# EAGLE design Test (EAGLE 6.4)
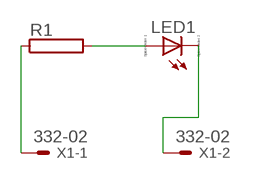
[diagram p0: schematic, sheet 1]

## Parts
LED1  LED_ELD260  [LED_LD260]
R1  RAC01  [AC01]
X1  332-02  [332-02]

## Nets
N$1: LED1.A R1.2
N$2: R1.1 X1.1
N$3: LED1.K(C) X1.2

## Library data of the parts
LED1 = eagle-ltspice:LED_E: LED Source: http://www.osram.convergy.de Source: www.luxeon.com Source: www.kingbright.com; SPICEMODEL: NONE; SPICEPREFIX: D; SPICETYPE: diode
R1 = resistor-power:R: Power Resitor; OC_FARNELL: unknown; OC_NEWARK: unknown
X1 = con-garry:332-02: 2 Pin - 2mm Dual Row Source: www.mpe-connector.de / garry_shortform_2012.pdf

## Board
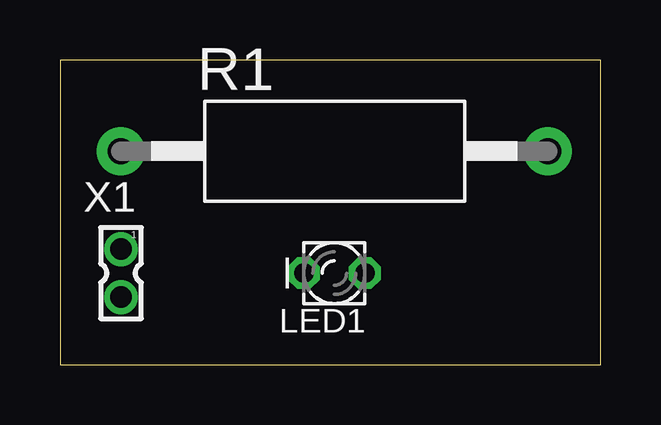
[diagram p1: board, top side]
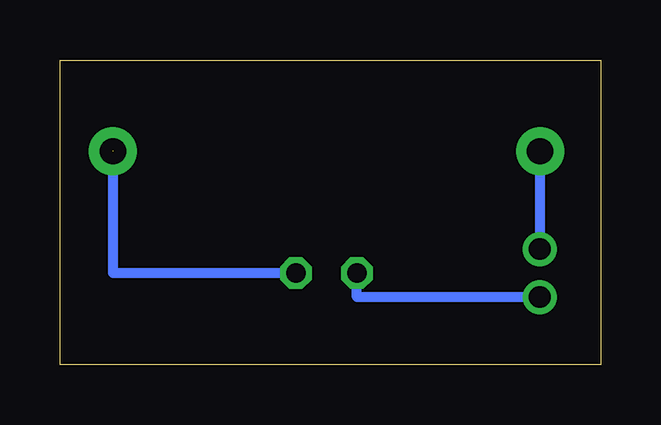
[diagram p2: board, bottom side, seen from below]

Size 22.53 x 12.69 mm. Coordinates in mm from the lower left corner, seen from the top.
Outline: 0,0 22.53,0 22.53,12.69 0,12.69 0,0
Copper layers (1*16): Top 0.035mm / dielectric 1.5mm / Bottom 0.035mm
Design rules "default": minimum track width 10mil, minimum drill 24mil, track to track 8mil, track to pad 8mil, pad to pad 8mil, via to via 8mil, smd to smd 8mil, copper to edge 40mil, drill to drill 8mil, minimum pad ring 10mil, minimum via ring 8mil, stop-mask expansion 4mil, vias tented up to drill 0mil, thermal gap 10mil

### Footprints (pad centres in the part's own frame; a part is rotated, then mirrored left to right if it is on the bottom)
LED_LD260 = drill 0.813 octagon: A -1.27,0; K 1.27,0
AC01 = drill 1.1 pad 2: 1 -8.9,0; 2 8.9,0
332-02 = drill 0.9 pad 1.27: 1 0,-1; 2 0,1

### Placement (x,y rotation side)
LED1  11.43,3.81 180 top
R1  11.43,8.89 0 top
X1  2.54,3.81 180 top

### Tracks (layer width: path | path; a pad name or v marks a point on that pad's centre or on a via)
N$1  (1 unrouted)
  Bottom 0.406: LED1.A 20.32,3.81 R1.2
N$2
  Bottom 0.406: X1.1 R1.1
N$3
  Bottom 0.406: X1.2 10.16,2.81 LED1.K